# EAGLE design PCB (EAGLE 8.1.0)
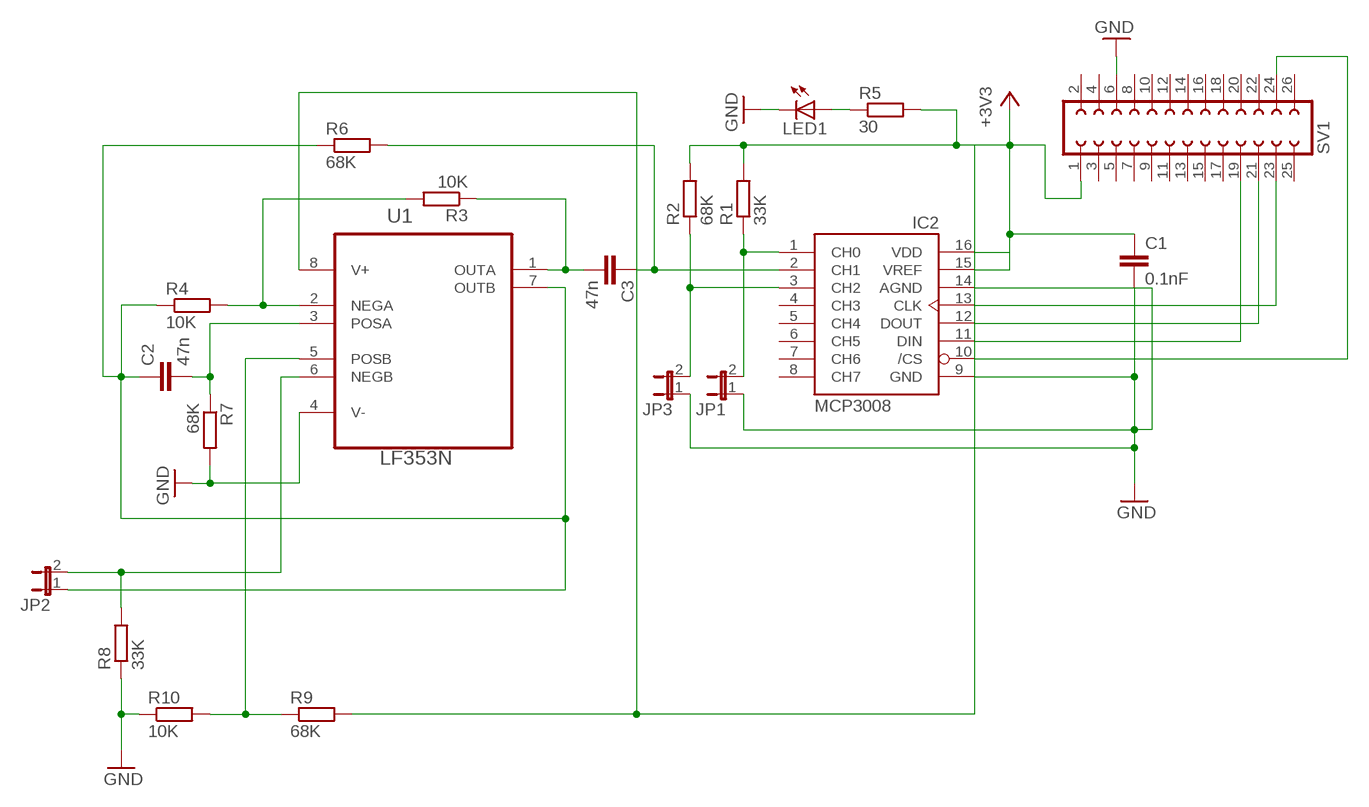
[diagram p0: schematic, sheet 1]

## Parts
C1  0.1nF  C-EU050-035X075  [C050-035X075]
C2  47n  C2.5/5  [C2.5-5]
C3  47n  C2.5/5  [C2.5-5]
IC2  MCP3008  [DIL16]
JP1  JP1E  [JP1]
JP2  JP1E  [JP1]
JP3  JP1E  [JP1]
LED1  LED5MM  [LED5MM]
R1  33K  R-EU_0207/10  [0207/10]
R2  68K  R-EU_0207/10  [0207/10]
R3  10K  R-EU_0207/10  [0207/10]
R4  10K  R-EU_0207/10  [0207/10]
R5  30  R-EU_0207/10  [0207/10]
R6  68K  R-EU_0207/10  [0207/10]
R7  68K  R-EU_0207/10  [0207/10]
R8  33K  R-EU_0207/10  [0207/10]
R9  68K  R-EU_0207/10  [0207/10]
R10  10K  R-EU_0207/10  [0207/10]
SV1  FE13-2  [FE13-2]
U1  LF353N  [DIP254P762X508-8]

## Nets
+3.3V: C1.1 IC2.15(VREF) IC2.16(VDD) R1.2 R2.2 R5.2 R9.2 SV1.1 U1.8(V+) ; supply symbol labelled +3V3
GND: C1.2 IC2.9(GND) IC2.14(AGND) JP1.1 JP3.1 LED1.K(C) R7.2 R8.1 R10.1 SV1.6 U1.4(V-)
N$1: IC2.10(/CS) SV1.24
N$2: IC2.13(CLK) SV1.23
N$3: IC2.11(DIN) SV1.19
N$4: IC2.12(DOUT) SV1.21
N$5: C2.2 R7.1 U1.3(POSA)
N$6: IC2.1(CH0) JP1.2 R1.1
N$7: LED1.A R5.1
N$8: R9.1 R10.2 U1.5(POSB)
N$9: JP2.2 R8.2 U1.6(NEGB)
N$10: IC2.3(CH2) JP3.2 R2.1
N$11: R3.2 R4.2 U1.2(NEGA)
N$12: C3.2 R3.1 U1.1(OUTA)
N$13: C3.1 IC2.2(CH1) R6.2
N$15: C2.1 JP2.1 R4.1 R6.1 U1.7(OUTB)
Unconnected: IC2.4(CH3) IC2.5(CH4) IC2.6(CH5) IC2.7(CH6) IC2.8(CH7) SV1.2 SV1.3 SV1.4 SV1.5 SV1.7 SV1.8 SV1.9 SV1.10 SV1.11 SV1.12 SV1.13 SV1.14 SV1.15 SV1.16 SV1.17 SV1.18 SV1.20 SV1.22 SV1.25 SV1.26

## Library data of the parts
C1 = rcl:C-EU: CAPACITOR, European symbol
C2 C3 = capacitor-wima:C: CAPACITOR naming: grid - package width
IC2 = adafruit:MCP3008
JP1-JP3 = jumper:JP1E: JUMPER
LED1 = adafruit:LED: LED OSRAM: - CHIPLED LG R971, LG N971, LY N971, LG Q971, LY Q971, LO R971, LY R971 LH N974, LH R974 LS Q976, LO Q976, LY Q976 LO Q996 - Hyper CHIPLED LW Q18S LB Q993, LB Q99A, LB R99A - SideLED LS A670, LO A670, LY A670, LG A670, LP A670 LB A673, LV A673, LT A673, LW A673 LH A674 LY A675 LS A676, LA A676, LO A676, LY A676, LW A676 LS A679, LY A679, LG A679 - Hyper Micro SIDELED® LS Y876, LA Y876, LO Y876, LY Y876 LT Y87S - SmartLED LW L88C, LW L88S LB L89C, LB L89S, LG L890 LS L89K, LO L89K, LY L89K LS L896, LA L896, LO L896, LY L896 - TOPLED LS T670, LO T670, LY T670, LG T670, LP T670 LSG T670, LSP T670, LSY T670, LOP T670, LYG T670 LG T671, LOG T671, LSG T671 LB T673, LV T673, LT T673, LW T673 LH T674 LS T676, LA T676, LO T676, LY T676, LB T676, LH T676, LSB T676, LW T676 LB T67C, LV T67C, LT T67C, LS T67K, LO T67K, LY T67K, LW E67C LS E67B, LA E67B, LO E67B, LY E67B, LB E67C, LV E67C, LT E67C LW T67C LS T679, LY T679, LG T679 LS T770, LO T770, LY T770, LG T770, LP T770 LB T773, LV T773, LT T773, LW T773 LH T774 LS E675, LA E675, LY E675, LS T675 LS T776, LA T776, LO T776, LY T776, LB T776 LHGB T686 LT T68C, LB T68C - Hyper Mini TOPLED® LB M676 - Mini TOPLED Santana® LG M470 LS M47K, LO M47K, LY M47K Source: http://www.osram.convergy.de/
R1-R10 = rpi_ad7705:R-EU_: RESISTOR, European symbol
SV1 = rpi_ad7705:FE13-2: FEMALE HEADER; OC_FARNELL: unknown; OC_NEWARK: unknown
U1 = LF353N:LF353N: OpAmpIC; AVAILABILITY: Unavailable; DESCRIPTION: Op Amp Dual IC 8-Pin DIP JFET IC 8-PIN DIP JFET OP AMP DUAL *SS Junction Field Effect Transistor, Voltage Rating: 5 -...; MF: MCM Electronics; MP: LF353N; PACKAGE: DIP-8 MCM Electronics; PRICE: None

## Board
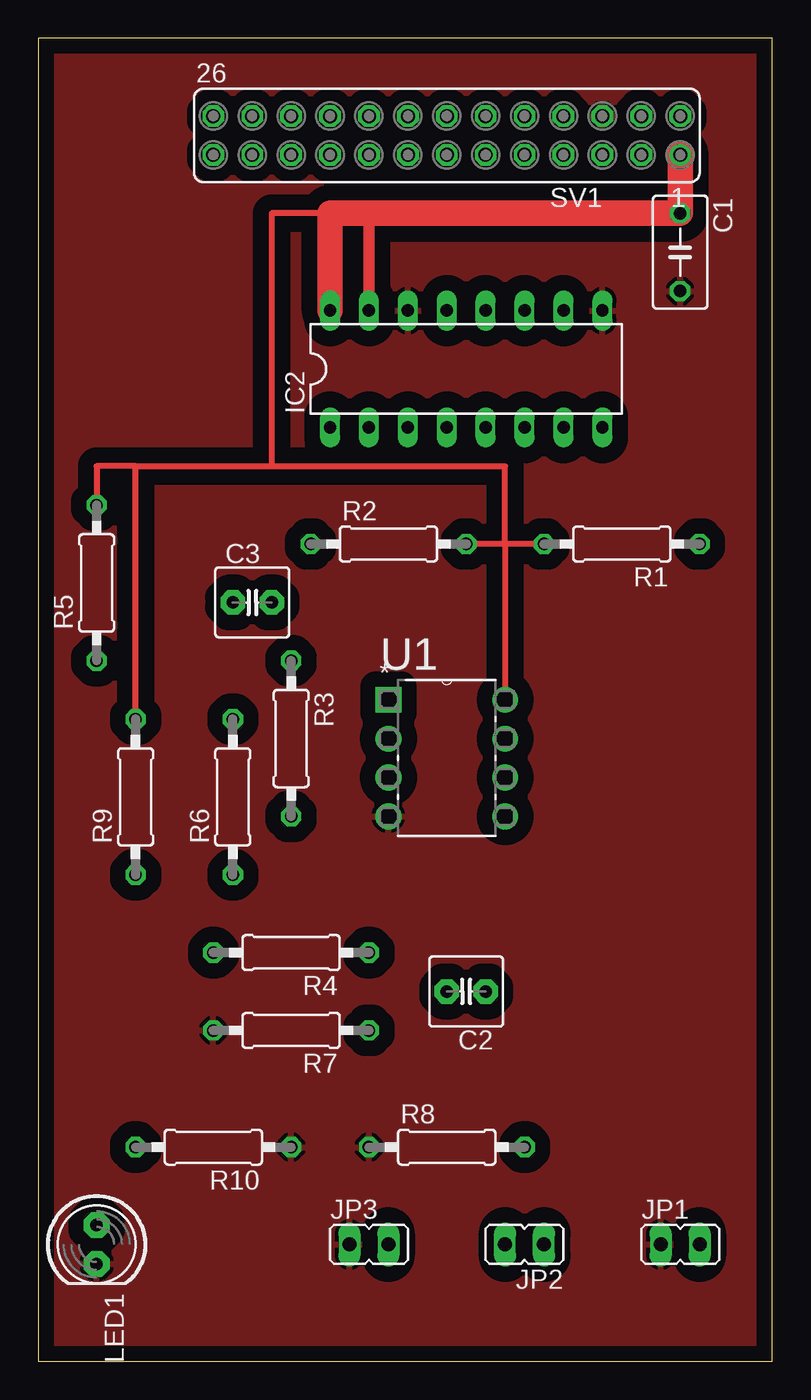
[diagram p1: board, top side]
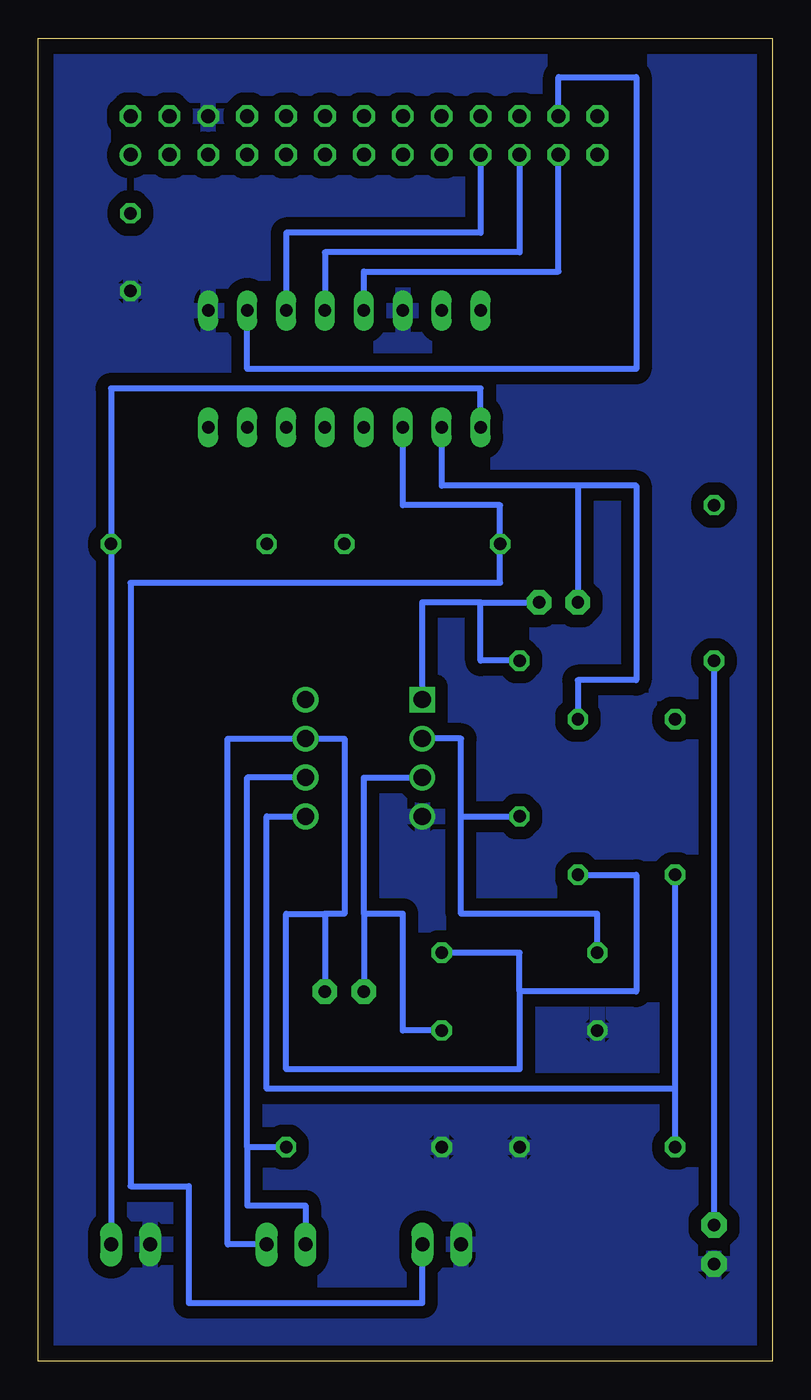
[diagram p2: board, bottom side, seen from below]

Size 47.93 x 86.35 mm. Coordinates in mm from the lower left corner, seen from the top.
Outline: 0,0 47.93,0 47.93,86.35 0,86.35 0,0
Copper layers (1*16): Top 0.035mm / dielectric 1.5mm / Bottom 0.035mm
Design rules "default": minimum track width 10mil, minimum drill 24mil, track to track 8mil, track to pad 8mil, pad to pad 8mil, via to via 8mil, smd to smd 8mil, copper to edge 40mil, drill to drill 8mil, minimum pad ring 10mil, minimum via ring 8mil, stop-mask expansion 4mil, vias tented up to drill 0mil, thermal gap 10mil

### Footprints (pad centres in the part's own frame; a part is rotated, then mirrored left to right if it is on the bottom)
C050-035X075 = drill 0.813 octagon: 1 -2.54,0; 2 2.54,0
C2.5-5 = drill 0.813 pad 1.6 octagon: 1 -1.27,0; 2 1.27,0
DIL16 = drill 0.813 long: 1 -8.89,-3.81; 2 -6.35,-3.81; 3 -3.81,-3.81; 4 -1.27,-3.81; 5 1.27,-3.81; 6 3.81,-3.81; 7 6.35,-3.81; 8 8.89,-3.81; 9 8.89,3.81; 10 6.35,3.81; 11 3.81,3.81; 12 1.27,3.81; 13 -1.27,3.81; 14 -3.81,3.81; 15 -6.35,3.81; 16 -8.89,3.81
JP1 = drill 0.914 long: 1 0,-1.27; 2 0,1.27
LED5MM = drill 0.813 pad 1.676 octagon: A -1.27,0; K 1.27,0
0207/10 = drill 0.813 octagon: 1 -5.08,0; 2 5.08,0
FE13-2 = drill 0.914: 1 -15.24,1.27 | drill 0.914 octagon: 2 -15.24,-1.27; 3 -12.7,1.27; 4 -12.7,-1.27; 5 -10.16,1.27; 6 -10.16,-1.27; 7 -7.62,1.27; 8 -7.62,-1.27; 9 -5.08,1.27; 10 -5.08,-1.27; 11 -2.54,1.27; 12 -2.54,-1.27; 13 0,1.27; 14 0,-1.27; 15 2.54,1.27; 16 2.54,-1.27; 17 5.08,1.27; 18 5.08,-1.27; 19 7.62,1.27; 20 7.62,-1.27; 21 10.16,1.27; 22 10.16,-1.27; 23 12.7,1.27; 24 12.7,-1.27; 25 15.24,1.27; 26 15.24,-1.27
DIP254P762X508-8 = drill 1.118 square: 1 -7.62,7.62 | drill 1.118: 2 -7.62,5.08; 3 -7.62,2.54; 4 -7.62,0; 5 0,0; 6 0,2.54; 7 0,5.08; 8 0,7.62

### Placement (x,y rotation side)
C1  41.91,72.39 270 top
C2  27.94,24.13 180 top
C3  13.97,49.53 0 top
IC2  27.94,64.77 0 top
JP1  41.91,7.62 270 top
JP2  31.75,7.62 90 top
JP3  21.59,7.62 270 top
LED1  3.81,7.62 270 top
R1  38.1,53.34 180 top
R2  22.86,53.34 0 top
R3  16.51,40.64 270 top
R4  16.51,26.67 180 top
R5  3.81,50.8 90 top
R6  12.7,36.83 90 top
R7  16.51,21.59 180 top
R8  26.67,13.97 0 top
R9  6.35,36.83 90 top
R10  11.43,13.97 180 top
SV1  26.67,80.01 180 top
U1  30.48,35.56 0 top

### Tracks (layer width: path | path; a pad name or v marks a point on that pad's centre or on a via)
+3.3V
  Top 0.406: R1.2 30.48,53.34 | 30.48,53.34 30.48,58.42 15.24,58.42 | 30.48,53.34 R2.2 | 6.35,58.42 15.24,58.42 | 6.35,58.42 3.81,58.42 R5.2 | 15.24,58.42 15.24,74.93 19.05,74.93 | R9.2 6.35,58.42 | 30.48,53.34 U1.8
  Top 0.75: IC2.15 21.59,74.93
  Top 1.676: SV1.1 C1.1 21.59,74.93 19.05,74.93 IC2.16
GND
  pour Top (isolate 1.016): 0,86.36 48.26,86.36 48.26,0 0,0
  pour Bottom (isolate 0.813): 0,86.36 48.26,86.36 48.26,0 0,0
N$1
  Bottom 0.406: SV1.24 13.97,83.82 8.89,83.82 8.89,64.77 34.29,64.77 IC2.10
N$2
  Bottom 0.406: IC2.13 26.67,71.12 13.97,71.12 SV1.23
N$3
  Bottom 0.406: SV1.19 19.05,73.66 31.75,73.66 IC2.11
N$4
  Bottom 0.406: SV1.21 16.51,72.39 29.21,72.39 IC2.12
N$5
  Bottom 0.406: 26.67,29.21 C2.2 | 26.67,29.21 26.67,38.1 U1.3 | R7.1 24.13,21.59 24.13,29.21 26.67,29.21
N$6
  Bottom 0.406: IC2.1 19.05,63.5 43.18,63.5 R1.1 JP1.2
N$7
  Bottom 0.406: R5.1 LED1.A
N$8
  Bottom 0.406: R10.2 6.35,17.78 | 6.35,17.78 R9.1 | 6.35,17.78 33.02,17.78 33.02,35.56 U1.5
N$9
  Bottom 0.406: U1.6 34.29,38.1 34.29,13.97 | 34.29,13.97 34.29,10.16 30.48,10.16 JP2.2 | R8.2 34.29,13.97
N$10
  Bottom 0.406: IC2.3 24.13,55.88 17.78,55.88 R2.1 17.78,50.8 41.91,50.8 41.91,11.43 38.1,11.43 38.1,3.81 22.86,3.81 JP3.2
N$11
  Bottom 0.406: 20.32,35.56 R3.2 | 20.32,35.56 20.32,40.64 U1.2 | R4.2 11.43,29.21 20.32,29.21 20.32,35.56
N$12
  Bottom 0.406: U1.1 22.86,49.53 19.05,49.53 | 19.05,49.53 C3.2 | R3.1 19.05,45.72 19.05,49.53
N$13
  Bottom 0.406: IC2.2 21.59,57.15 12.7,57.15 | 12.7,57.15 C3.1 | R6.2 12.7,44.45 8.89,44.45 8.89,57.15 12.7,57.15
N$15
  Bottom 0.406: JP2.1 35.56,7.62 35.56,40.64 U1.7 27.94,40.64 27.94,29.21 29.21,29.21 | 29.21,29.21 C2.1 | R4.1 16.51,26.67 16.51,24.13 | 16.51,24.13 16.51,19.05 31.75,19.05 31.75,29.21 29.21,29.21 | R6.1 8.89,31.75 8.89,24.13 16.51,24.13